# Altium schematic sheet HPF.SchDoc
size 209 x 297 mm; PageSetup: Record=PageOptions|CenterHorizontal=False|CenterVertical=False|PrintScale=1.00|XCorrection=0.00|YCorrection=0.00|PrintKind=0|BorderSize=5000000|LeftOffset=0|BottomOffset=0|Orientation=2|PaperLength=1000|PaperWidth=1000|Scale=100|PaperSource=15|PrintQuality=-3|MediaType=1|DitherType=10|PrintScaleMode=0|PaperKind=A3|PaperIndex=8; TitleBlock_02_DocumentDesignator: BCAD.123456.001 Э3; TitleBlock_07_SheetNumber: 6
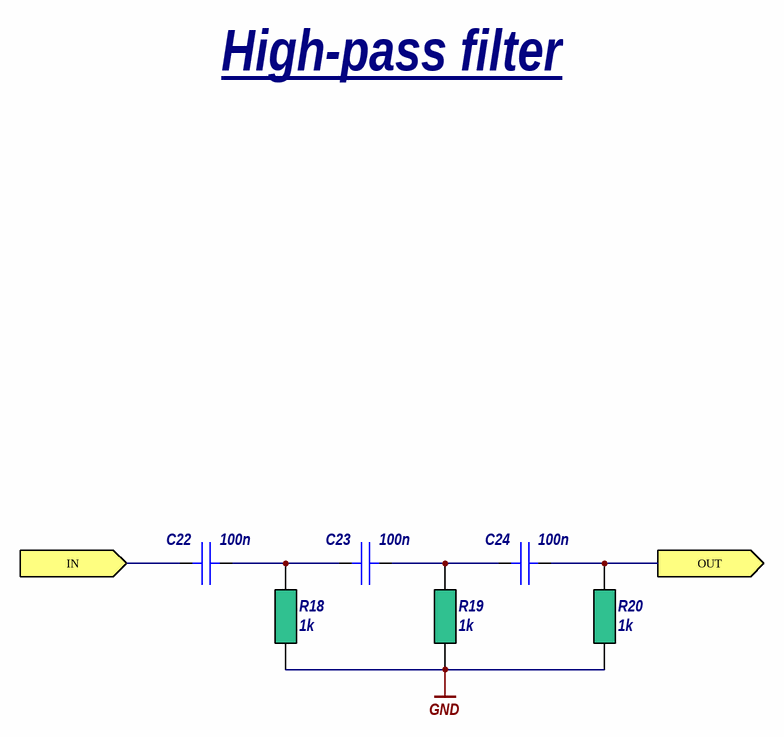
[diagram p0: HPF.SchDoc]

## Parts
C22  100n  [MLCC_0603]
C23  100n  [MLCC_0603]
C24  100n  [MLCC_0603]
R18  1k  [RC_0603]
R19  1k  [RC_0603]
R20  1k  [RC_0603]

## Ports
IN (in), OUT (out)

## Nets
GND: R18.1 R19.1 R20.1
IN: C22.2 ; port IN
OUT: C24.1 R20.2 ; port OUT
NetC22_1: C22.1 C23.2 R18.2
NetC23_1: C23.1 C24.2 R19.2

## Notes on the sheet
- High-pass filter
- Подп. и дата
- Инв. № дубл.
- Взам. инв. №
- Инв. № подл.
- Изм.
- Лист
- № докум.
- Подп.
- Дата
- Копировал
- Формат А4

## Library data of the parts
C22-C24 = Capacitor nonpolar: Nonpolar capacitor, generic; BOM_manufacturer: YAGEO; BOM_value: CC0603KRX7R9BB104; BOM_type: Конденсатор; BOM_description: керам., чип 0603, X7R, 0.1мкФ ±10%, 50В; BOM_explicit: false; SCH_value: 100n
R18-R20 = Resistor: Fixed-value resistor, generic; BOM_manufacturer: YAGEO; BOM_value: RC0603FR-071KL; BOM_type: Резистор; BOM_description: чип 0603, 1кОм ±1%; BOM_explicit: false; SCH_value: 1k